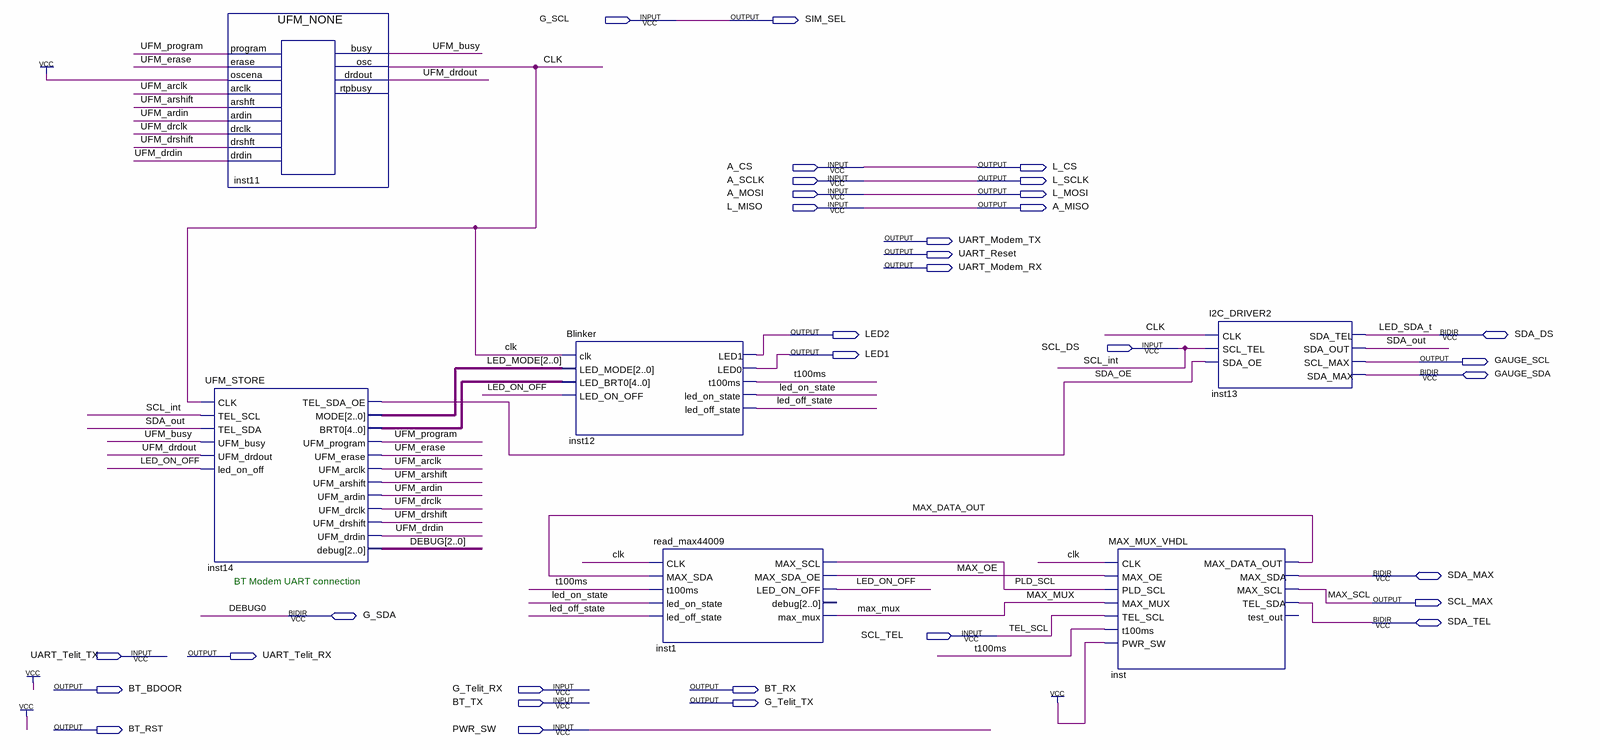
[diagram p0: schematic sheet]
// Quartus schematic MAXV_FULL.bdf as structural Verilog: 6 symbols, 33 pins
module MAXV_FULL (
  input  G_SCL,
  input  A_CS,
  input  A_SCLK,
  input  A_MOSI,
  input  L_MISO,
  input  SCL_DS,
  input  SCL_TEL,
  input  UART_Telit_TX,
  input  G_Telit_RX,
  input  BT_TX,
  input  PWR_SW,
  inout  SDA_DS,
  inout  GAUGE_SDA,
  inout  SDA_MAX,
  inout  G_SDA,
  inout  SDA_TEL,
  output SIM_SEL,
  output L_CS,
  output L_SCLK,
  output L_MOSI,
  output A_MISO,
  output UART_Modem_TX,
  output UART_Reset,
  output UART_Modem_RX,
  output LED2,
  output LED1,
  output GAUGE_SCL,
  output SCL_MAX,
  output UART_Telit_RX,
  output BT_BDOOR,
  output BT_RX,
  output G_Telit_TX,
  output BT_RST
);

  wire clk, led_off_state, LED_ON_OFF, led_on_state, MAX_DATA_OUT, MAX_MUX, MAX_OE, PLD_SCL, SDA_OE, SDA_out,
       t100ms, UFM_arclk, UFM_ardin, UFM_arshift, UFM_busy, UFM_drclk, UFM_drdin, UFM_drdout, UFM_drshift,
       UFM_erase, UFM_program;
  wire [2:0] LED_MODE;
  wire [2:1] DEBUG;
  wire [4:0] inst14_brt0;

  UFM_NONE inst11 (
    .\program (UFM_program), .erase(UFM_erase), .oscena(1'b1), .arclk(UFM_arclk), .arshft(UFM_arshift),
    .ardin(UFM_ardin), .drclk(UFM_drclk), .drshft(UFM_drshift), .drdin(UFM_drdin), .busy(UFM_busy),
    .osc(clk), .drdout(UFM_drdout));  // open: rtpbusy
  UFM_STORE inst14 (
    .CLK(clk), .TEL_SCL(SCL_DS), .TEL_SDA(SDA_out), .UFM_busy(UFM_busy), .UFM_drdout(UFM_drdout),
    .led_on_off(LED_ON_OFF), .TEL_SDA_OE(SDA_OE), .MODE(LED_MODE), .BRT0(inst14_brt0),
    .UFM_program(UFM_program), .UFM_erase(UFM_erase), .UFM_arclk(UFM_arclk), .UFM_arshift(UFM_arshift),
    .UFM_ardin(UFM_ardin), .UFM_drclk(UFM_drclk), .UFM_drshift(UFM_drshift), .UFM_drdin(UFM_drdin),
    .debug({DEBUG, G_SDA}));
  Blinker inst12 (
    .clk(clk), .LED_MODE(LED_MODE), .LED_BRT0(inst14_brt0), .LED_ON_OFF(LED_ON_OFF), .LED1(LED2),
    .LED0(LED1), .t100ms(t100ms), .led_on_state(led_on_state), .led_off_state(led_off_state));
  read_max44009 inst1 (
    .CLK(clk), .MAX_SDA(MAX_DATA_OUT), .t100ms(t100ms), .led_on_state(led_on_state),
    .led_off_state(led_off_state), .MAX_SCL(PLD_SCL), .MAX_SDA_OE(MAX_OE), .LED_ON_OFF(LED_ON_OFF),
    .max_mux(MAX_MUX));  // open: debug
  MAX_MUX_VHDL inst (
    .CLK(clk), .MAX_OE(MAX_OE), .PLD_SCL(PLD_SCL), .MAX_MUX(MAX_MUX), .TEL_SCL(SCL_TEL), .t100ms(t100ms),
    .PWR_SW(1'b1), .MAX_DATA_OUT(MAX_DATA_OUT), .MAX_SCL(SCL_MAX), .MAX_SDA(SDA_MAX), .TEL_SDA(SDA_TEL));  // open: test_out
  I2C_DRIVER2 inst13 (
    .CLK(clk), .SCL_TEL(SCL_DS), .SDA_OE(SDA_OE), .SDA_OUT(SDA_out), .SCL_MAX(GAUGE_SCL), .SDA_TEL(SDA_DS),
    .SDA_MAX(GAUGE_SDA));

  assign A_MISO = L_MISO;
  assign L_CS = A_CS;
  assign L_MOSI = A_MOSI;
  assign L_SCLK = A_SCLK;
  assign SIM_SEL = G_SCL;

  // Other names for the same wires on the sheet: DEBUG[0] = G_SDA; DEBUG0 = G_SDA; LED_SDA_t = SDA_DS;
  //   MAX_SCL = SCL_MAX; SCL_int = SCL_DS; TEL_SCL = SCL_TEL

  // Notes on the sheet:
  //   BT Modem UART connection
endmodule
